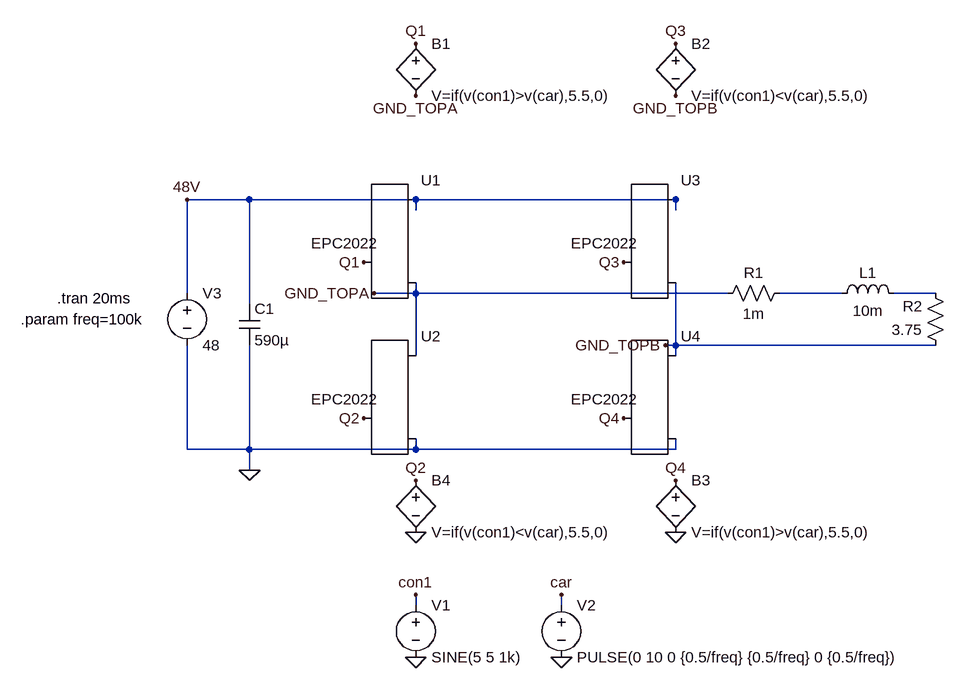
[diagram p0: schematic H-Bridge_EPC2022.asc]
H-Bridge_EPC2022.asc, the LTspice schematic file:
Version 4
SHEET 1 1956 680
WIRE -1152 -80 -1248 -80
WIRE -896 -80 -1152 -80
WIRE -496 -80 -896 -80
WIRE -896 -64 -896 -80
WIRE -496 -64 -496 -80
WIRE -1248 64 -1248 -80
WIRE -896 64 -896 48
WIRE -896 64 -960 64
WIRE -416 64 -896 64
WIRE -240 64 -336 64
WIRE -96 64 -160 64
WIRE -1152 80 -1152 -80
WIRE -496 144 -496 48
WIRE -496 144 -512 144
WIRE -96 144 -496 144
WIRE -896 160 -896 64
WIRE -496 160 -496 144
WIRE -1248 304 -1248 144
WIRE -1152 304 -1152 144
WIRE -1152 304 -1248 304
WIRE -896 304 -896 288
WIRE -896 304 -1152 304
WIRE -496 304 -496 288
WIRE -496 304 -896 304
WIRE -1152 336 -1152 304
WIRE -896 544 -896 528
WIRE -672 544 -672 528
FLAG -896 -320 Q1
FLAG -896 528 con1
FLAG -672 528 car
FLAG -896 624 0
FLAG -672 624 0
FLAG -496 -320 Q3
FLAG -496 432 0
FLAG -496 352 Q4
FLAG -896 432 0
FLAG -896 352 Q2
FLAG -976 16 Q1
FLAG -576 16 Q3
FLAG -976 256 Q2
FLAG -576 256 Q4
FLAG -960 64 GND_TOPA
FLAG -1248 -80 48V
FLAG -496 -240 GND_TOPB
FLAG -896 -240 GND_TOPA
FLAG -512 144 GND_TOPB
FLAG -1152 336 0
SYMBOL bv -896 -336 R0
SYMATTR InstName B1
SYMATTR Value V=if(v(con1)>v(car),5.5,0)
SYMBOL bv -496 -336 R0
SYMATTR InstName B2
SYMATTR Value V=if(v(con1)<v(car),5.5,0)
SYMBOL cap -1168 80 R0
SYMATTR InstName C1
SYMATTR Value 590µ
SYMBOL voltage -1248 48 R0
WINDOW 123 0 0 Left 0
WINDOW 39 0 0 Left 0
SYMATTR InstName V3
SYMATTR Value 48
SYMBOL voltage -896 528 R0
WINDOW 123 0 0 Left 0
WINDOW 39 0 0 Left 0
SYMATTR InstName V1
SYMATTR Value SINE(5 5 1k)
SYMBOL voltage -672 528 R0
WINDOW 123 0 0 Left 0
WINDOW 39 0 0 Left 0
SYMATTR InstName V2
SYMATTR Value PULSE(0 10 0 {0.5/freq} {0.5/freq} 0 {0.5/freq})
SYMBOL bv -496 336 R0
SYMATTR InstName B3
SYMATTR Value V=if(v(con1)>v(car),5.5,0)
SYMBOL bv -896 336 R0
SYMATTR InstName B4
SYMATTR Value V=if(v(con1)<v(car),5.5,0)
SYMBOL EPCGaN -976 16 R0
WINDOW 3 -81 -29 Left 2
SYMATTR Value EPC2022
SYMATTR InstName U1
SYMBOL EPCGaN -576 16 R0
WINDOW 3 -81 -29 Left 2
SYMATTR Value EPC2022
SYMATTR InstName U3
SYMBOL EPCGaN -576 256 R0
WINDOW 3 -81 -29 Left 2
SYMATTR Value EPC2022
SYMATTR InstName U4
SYMBOL EPCGaN -976 256 R0
WINDOW 3 -81 -29 Left 2
SYMATTR Value EPC2022
SYMATTR InstName U2
SYMBOL ind -256 80 R270
WINDOW 0 32 56 VTop 2
WINDOW 3 5 56 VBottom 2
SYMATTR InstName L1
SYMATTR Value 10m
SYMBOL res -320 48 R90
WINDOW 0 0 56 VBottom 2
WINDOW 3 32 56 VTop 2
SYMATTR InstName R1
SYMATTR Value 1m
SYMBOL res -80 160 R180
WINDOW 0 36 76 Left 2
WINDOW 3 36 40 Left 2
SYMATTR InstName R2
SYMATTR Value 3.75
TEXT -1448 72 Left 2 !.tran 20ms
TEXT -1504 104 Left 2 !.param freq=100k

The netlist it stands for:
* H-Bridge_EPC2022.asc
B1 Q1 GND_TOPA V=if(v(con1)>v(car),5.5,0)
B2 Q3 GND_TOPB V=if(v(con1)<v(car),5.5,0)
C1 48V 0 590µ
V3 48V 0 48
V1 con1 0 SINE(5 5 1k)
V2 car 0 PULSE(0 10 0 {0.5/freq} {0.5/freq} 0 {0.5/freq})
B3 Q4 0 V=if(v(con1)>v(car),5.5,0)
B4 Q2 0 V=if(v(con1)<v(car),5.5,0)
XU1 Q1 48V GND_TOPA EPC2022
XU3 Q3 48V GND_TOPB EPC2022
XU4 Q4 GND_TOPB 0 EPC2022
XU2 Q2 GND_TOPA 0 EPC2022
L1 N001 N002 10m
R1 N001 GND_TOPA 1m
R2 GND_TOPB N002 3.75
.tran 20ms
.param freq=100k
.backanno
.end